# Altium schematic sheet ThreeStagePipelineCPU.SchDoc
size 281 x 215 mm
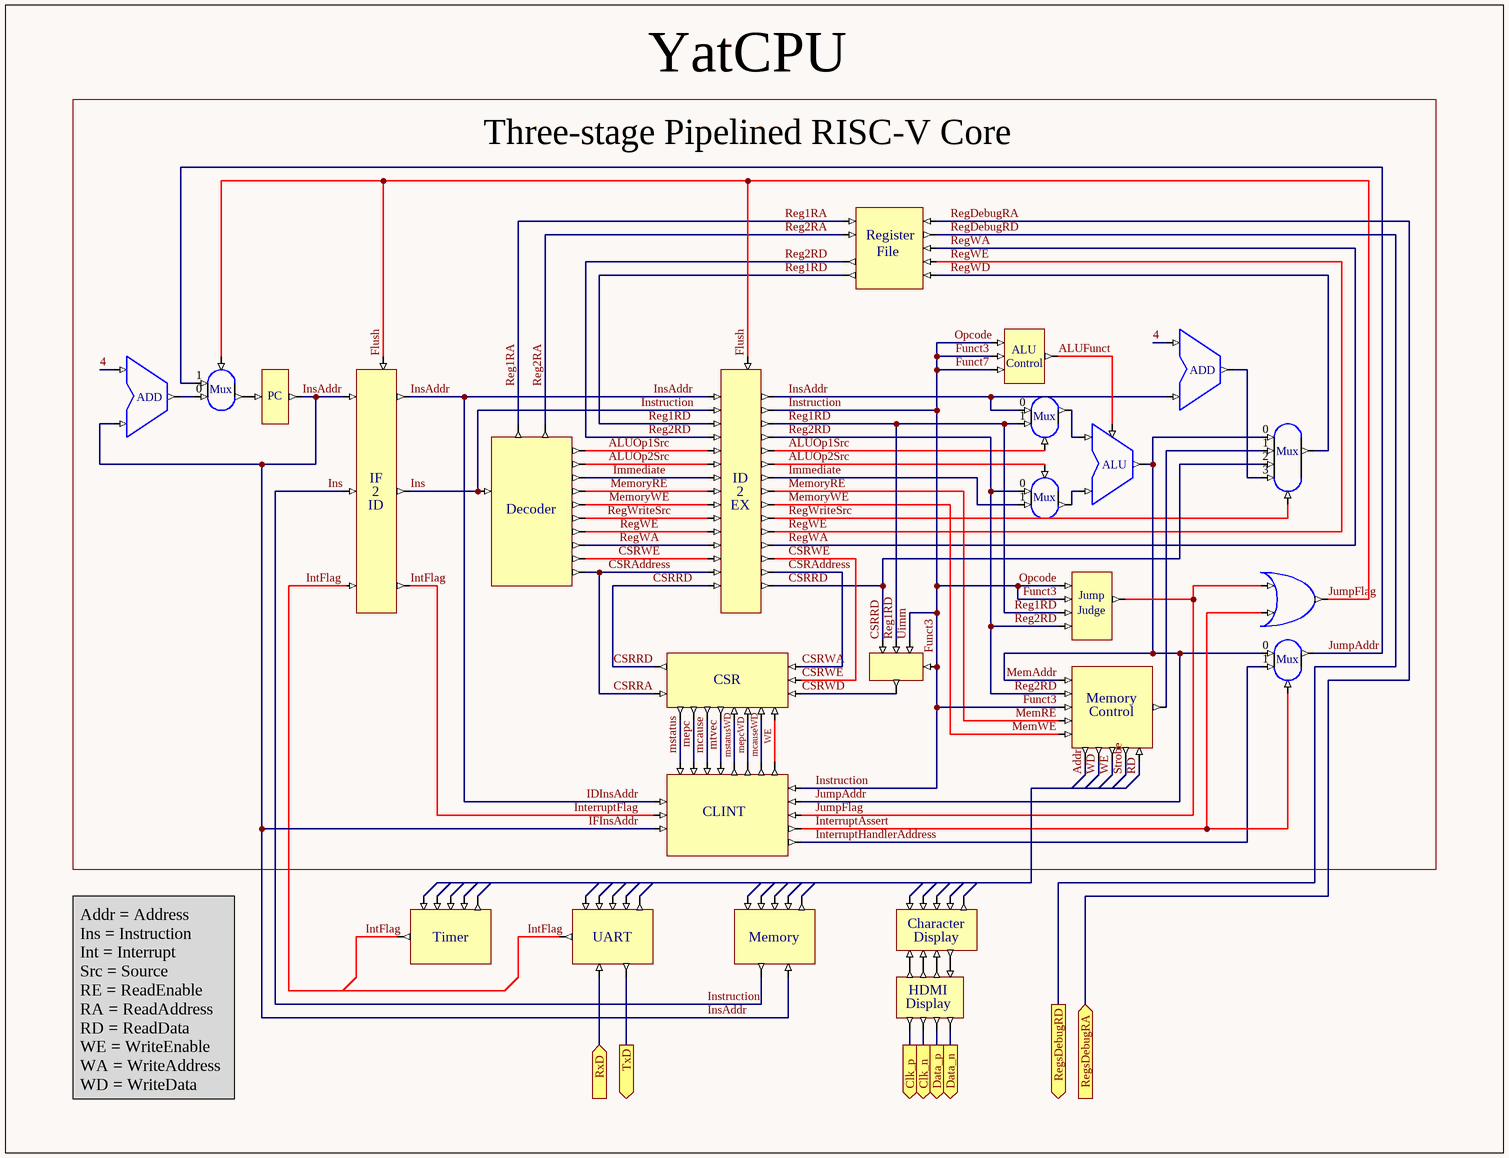
[diagram p0: ThreeStagePipelineCPU.SchDoc]

## Parts
(Parts that share a designator on the sheet are numbered #1, #2 ... from top to bottom, then left to right.)
*#1  RegFile  (value not drawn)
*#2  ALUControl  (value not drawn)
*#3  ADD  (value not drawn)
*#4  ADD  (value not drawn)
*#5  Mux2  (value not drawn)
*#6  Mux2‘  (value not drawn)
*#7  ALU  (value not drawn)
*#8  Mux4  (value not drawn)
*#9  JumpJudge  (value not drawn)
*#10  OR  (value not drawn)
*#11  Mux2‘  (value not drawn)
*#12  CSR  (value not drawn)
*#13  CSRCompute  (value not drawn)
*#14  MemoryControl  (value not drawn)
*#15  CLINT  (value not drawn)
*#16  Timer  (value not drawn)
*#17  UART  (value not drawn)
*#18  Memory  (value not drawn)
*#19  CharacterDisplay  (value not drawn)
*#20  HDMIDisplay  (value not drawn)
*?  Mux2  (value not drawn)
ID  ID  (value not drawn)
ID/EX  PipelineReg14  (value not drawn)
IF/ID  PipelineReg3  (value not drawn)
Reg1  PC

## Blocks framed on the sheet
YatCPU: *#1-*#15 *? ID ID/EX IF/ID Reg1

## Ports
Clk_n (out), Clk_p (out), Data_n (out), Data_p (out), RegsDebugRA (in), RegsDebugRD (out), RxD (in), TxD (out)

## Nets
4: *#3.0(in0) *#4.0(in0)
Addr: *#14.10
ALUFunct: *#2.41 *#7.3
ALUOp1Src: *#6.3(select) ID.22 ID/EX.16 ID/EX.26
ALUOp2Src: *?.3(select) ID.14 ID/EX.17 ID/EX.27
Clk_n: *#20.47 ; port Clk_n
Clk_p: *#20.46 ; port Clk_p
CSRAddress: *#12.22 *#12.28 ID.23 ID/EX.6 ID/EX.34  [also labelled CSRWA]
CSRRD: *#8.2(in1) *#12.27 *#13.37 ID/EX.5(in) ID/EX.8
CSRWD: *#12.24 *#13.40
CSRWE: *#12.23 ID.21 ID/EX.11 ID/EX.33
Data_n: *#20.45 ; port Data_n
Data_p: *#20.48 ; port Data_p
Flush: *#5.3(select) *#9.40 *#10.1 *#10.3 *#15.23 ID/EX.10(FlushEnable) IF/ID.10  [also labelled JumpFlag]
Funct3: *#2.38 *#2.39 *#2.40 *#9.38 *#9.39 *#13.38 *#13.39 *#14.6 *#15.26 *#18.45 ID.11 ID/EX.13 ID/EX.23 IF/ID.3(in) IF/ID.7  [also labelled Funct7, Ins, Instruction, Opcode, Uimm]
IDInsAddr: *#3.1(in1) *#4.1(in1) *#6.0(in0) *#15.27 *#15.28 *#18.46 ID/EX.2(in) ID/EX.12 IF/ID.2(in) IF/ID.6 Reg1.1(OUT)  [also labelled IFInsAddr, InsAddr]
Immediate: *?.1(in1) ID.15 ID/EX.18 ID/EX.28
InterruptAssert: *#10.2 *#11.3(select) *#15.24
InterruptFlag: *#15.29 IF/ID.8  [also labelled IntFlag]
InterruptHandlerAddress: *#11.1(in1) *#15.25
JumpAddr: *#5.1(in0) *#7.2(out) *#8.0(in0) *#11.0(in0) *#11.2(out) *#14.4 *#15.22  [also labelled MemAddr]
mcause: *#12.30 *#15.16
mcauseWD: *#12.34 *#15.20
MemoryRE: *#14.7 ID.16 ID/EX.3(in) ID/EX.7  [also labelled MemRE]
MemoryWE: *#14.8 ID.17 ID/EX.19 ID/EX.29  [also labelled MemWE]
mepc: *#12.29 *#15.15
mepcWD: *#12.33 *#15.19
mstatus: *#12.29 *#15.15
mstatusWD: *#12.32 *#15.18
mtvec: *#12.31 *#15.17
RD: *#14.13
Reg1RA: *#1.28 ID.12
Reg1RD: *#1.31 *#6.1(in1) *#9.36 *#13.36 ID/EX.14 ID/EX.24
Reg2RA: *#1.29 ID.13
Reg2RD: *#1.30 *#9.37 *#14.5 *?.0(in0) ID/EX.15 ID/EX.25
RegDebugRA: *#1.35 ; port RegsDebugRA
RegDebugRD: *#1.36 ; port RegsDebugRD
RegWA: *#1.32 ID.20 ID/EX.22 ID/EX.32
RegWD: *#1.34 *#8.4(out)
RegWE: *#1.33 ID.19 ID/EX.21 ID/EX.31
RegWriteSrc: *#8.5(select) ID.18 ID/EX.20 ID/EX.30
RxD: *#17.46 ; port RxD
Strobe: *#14.11
TxD: *#17.47 ; port TxD
WD: *#14.14
WE: *#12.35 *#14.12 *#15.21
Net*#3_2: *#3.2(out) *#8.3(in3)
Net*#4_2: *#4.2(out) *#5.0(in1)
Net*#5_2: *#5.2(out) Reg1.0(IN)
Net*#6_2: *#6.2(out) *#7.0(in0)
Net*#7_1: *#7.1(in1) *?.2(out)
Net*#8_1: *#8.1(in1) *#14.9
Net*#19_45: *#19.45 *#20.44
Net*#19_46: *#19.46 *#20.43
Net*#19_47: *#19.47 *#20.43
Net*#19_48: *#19.48 *#20.43

Not connected (* = marked no-connect by the designer): *#16 43 44 45; *#17 43 44 45; *#18 43 44; *#19 43 44; IF/ID 5(in)

## Buses and harness runs
bus IntFlag

## Notes on the sheet
- Three-stage Pipelined RISC-V Core
- Addr = Address
  Ins = Instruction
  Int = Interrupt
  Src = Source
  RE = ReadEnable
  RA = ReadAddress
  RD = ReadData
  WE = WriteEnable
  WA = WriteAddress
  WD = WriteData
- Labels drawn without touching a wire or pin: CSRRA, CSRRD, Ins, IntFlag, Opcode
- (in symbol ALUControl) ALU; Control
- (in symbol CharacterDisplay) Character; Display
- (in symbol HDMIDisplay) HDMI; Display
- (in symbol ID) Decoder
- (in symbol JumpJudge) Jump; Judge
- (in symbol MemoryControl) Memory; Control
- (in symbol Mux2) Mux
- (in symbol Mux2‘) Mux
- (in symbol Mux4) Mux
- (in symbol PipelineReg3) IF; ID
- (in symbol PipelineReg14) ID; EX
- (in symbol RegFile) Register; File

## Library data of the parts
Reg1 = Reg